# Altium schematic sheet SH4 - 17V BUCK CONVERTER.SchDoc: Power Distribution Board Rev2 - 17V Buck Converter
size Letter; DrawnBy: Cindy Li; Organization: Altium Limited; Address1: L3, 12a Rodborough Rd; Address2: Frenchs Forest; Address3: NSW; Address4: Australia 2086
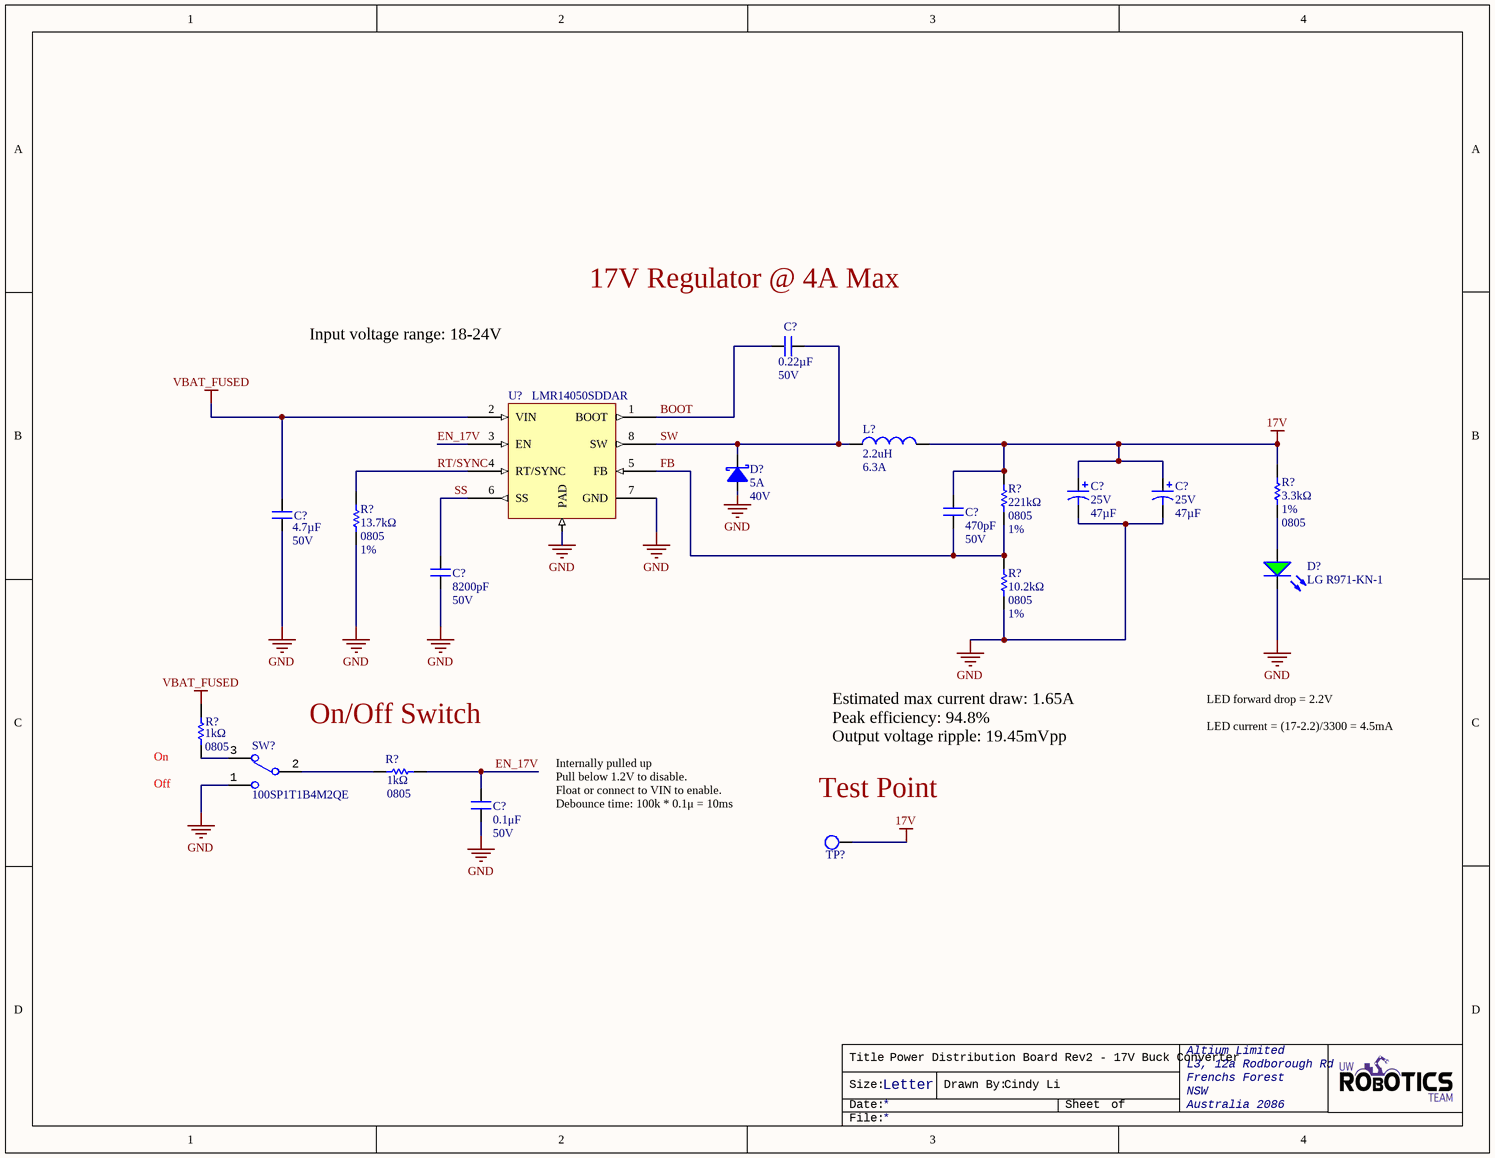
[diagram p0: SH4 - 17V BUCK CONVERTER.SchDoc]

## Parts
(Parts that share a designator on the sheet are numbered #1, #2 ... from top to bottom, then left to right.)
C?#1  Voltage Rating: 50V  Capacitance: 0.22µF  [CAP 0805_2012]  (hidden comment: GRM21BR71H224MA01L)
C?#2  Voltage: 25V  [25SVPF47M]  (hidden comment: 47μF)
C?#3  Voltage: 25V  [25SVPF47M]  (hidden comment: 47μF)
C?#4  470pF  Voltage Rating: 50V  [CAP 0805_2012]
C?#5  Voltage Rating: 50V  Capacitance: 4.7µF  [CAPC1206(3216)]  (hidden comment: GRM31CR71H475KA12L)
C?#6  8200pF  Voltage Rating: 50V  [CAP 0805_2012]
C?#7  0.1μF  Voltage Rating: 50V  [CAPC2012X140N]
D?#1  Forward Current: 5A  Voltage: 40V  [DO214AB SMC]  (hidden comment: B540C-13-F)
D?#2  LG R971-KN-1  [LED_0805_LINE]
L?  Inductance: 2.2uH  Max DC Current: 6.3A  [IND_BOURNS_SRN80]  (hidden comment: SRN8040-2R2Y)
R?#1  3.3kΩ  Tolerance: 1%  Case Code (Imperial): 0805  [RESC2012X60N]
R?#2  221kΩ  Case Code (Imperial): 0805  Tolerance: 1%  [RESC2012X60N]
R?#3  13.7kΩ  Case Code (Imperial): 0805  Tolerance: 1%  [RESC2012X60N]
R?#4  10.2kΩ  Case Code (Imperial): 0805  Tolerance: 1%  [RESC2012X60N]
R?#5  Case Code (Imperial): 0805  [RESC2012X60N]  (hidden comment: 1kΩ)
R?#6  1kΩ  Case Code (Imperial): 0805  [RESC2012X60N]
SW?  100SP1T1B4M2QE  [100SP1T1B4M2QE]
TP?  TESTPOINT_LOOP  [TESTPOINT_LOOP]  (value not drawn)
U?  LMR14050SDDAR  [8-PowerSOIC]

## Nets
17V: C?#2.1 C?#3.1 C?#4.2 L?.2 R?#1.2 R?#2.2 TP?.1
GND: C?#2.2 C?#3.2 C?#5.2 C?#6.1 C?#7.1 D?#1.1(Anode) D?#2.2(K) R?#3.1 R?#4.1 SW?.1 U?.7(GND) U?.9(PAD)
VBAT_FUSED: C?#5.1 R?#5.2 U?.2(VIN)
BOOT: C?#1.2 U?.1(BOOT)
EN_17V: C?#7.2 R?#6.2 U?.3(EN)
FB: C?#4.1 R?#2.1 R?#4.2 U?.5(FB)
RT/SYNC: R?#3.2 U?.4(RT/SYNC)
SS: C?#6.2 U?.6(SS)
SW: C?#1.1 D?#1.2(Cathode) L?.1 U?.8(SW)
NetD?#2_1: D?#2.1(A) R?#1.1
NetR?#5_1: R?#5.1 SW?.3
NetR?#6_1: R?#6.1 SW?.2

## Notes on the sheet
- (near C?#1) 17V Regulator @ 4A Max
- Input voltage range: 18-24V
- (near R?#5) On
- On/Off Switch
- Estimated max current draw: 1.65A
  Peak efficiency: 94.8%
  Output voltage ripple: 19.45mVpp
- LED forward drop = 2.2V
  LED current = (17-2.2)/3300 = 4.5mA
- (near R?#5) Off
- Internally pulled up
  Pull below 1.2V to disable.
  Float or connect to VIN to enable.
  Debounce time: 100k * 0.1μ = 10ms
- (near TP?) Test Point
- Title
- Size:
- Date:
- Letter
- Drawn By:
- Sheet
- of
- File:

## Library data of the parts
C?#1 = GRM21BR71H224MA01L: CAP CER 0.22UF 50V X7R 0805; Manufacturer 1: Murata; Tolerance: 20%; Manufacturer Part Number 1: GRM21BR71H224MA01L; Mount: Surface Mount; Case/Package: 0805; Case Code (Metric): 2012; Case Code (Imperial): 0805; Min Operating Temperature: -55°C; Max Operating Temperature: 125°C; Dielectric: X7R; Termination: SMD/SMT; Voltage Rating (DC): 50V; Length: 2mm; Height: 1.25mm; Width: 0.049inch; Thickness: 0.053inch; Depth: 1.25mm; Supplier 1: Digi-Key; Supplier Part Number 1: 490-1671-1-ND; Package: 0805 (2012 Metric)
C?#2 C?#3 = 25SVPF47M: CAP ALUM POLY 47UF 20% 25V SMD; Manufacturer 1: Panasonic; Polarity: Polar; Leakage Current: 235uA; Life (Hours): 5000Hour; Dissipation Factor: 12%; ESR (Equivalent Series Resistance): 30mR; Ripple Current: 2.8A; Clamping Voltage: 35.5V; Peak Pulse Power: 400W; Reverse Standoff Voltage: 22V; Peak Pulse Current: 11.3A; Test Current: 1mA; Breakdown Voltage: 24.4V; Number of Channels: 1; Direction: Unidirectional; Max Reverse Leakage Current: 1uA; Element Configuration: Single; Max Breakdown Voltage: 26.9V; Max Forward Surge Current (Ifsm): 40A; Working Voltage: 3.5V; Current: 113A; Supplier 1: Digi-Key; Manufacturer Part Number 1: 25SVPF47M; Mount: Surface Mount; Case/Package: Radial; Number of Pins: 6; Min Operating Temperature: -55°C; Max Operating Temperature: 105°C; Termination: SMD/SMT; Tolerance: 20%; Voltage Rating: 25V; Ripple Current (AC): 2.8A; Voltage Rating (DC): 25V; Diameter: 6.3mm; Length: 5.9mm; Height: 5.9mm; Height - Seated (Max): 0.236inch; REACH SVHC: No SVHC; Supplier Part Number 1: P16513CT-ND; Capacitance: 47µF; Max Surge Current: 11.3A; Operating Supply Voltage: 22V; Min Breakdown Voltage: 24.4V; Number of Elements: 1; Reverse Breakdown Voltage: 24.4V; Max Power Dissipation: 400W; Power Dissipation: 400W; Width: 0.11inch
C?#4 = CAP_470pF_50V_0805: CAP CER 470PF 50V X7R 0805; Manufacturer 1: Kyocera AVX; Manufacturer Part Number 1: 08055C471JAT2A; Tolerance: 5%; Dissipation Factor: 2.5%; Supplier 1: Digi-Key; Mount: Surface Mount; Number of Pins: 2; Case Code (Metric): 2012; Case Code (Imperial): 0805; Min Operating Temperature: -55°C; Max Operating Temperature: 125°C; Dielectric: X7R; Voltage Rating (DC): 50V; Termination: SMD/SMT; Length: 2.01mm; Height: 0.94mm; Width: 0.049inch; Thickness: 0.037inch; Depth: 1.25mm; REACH SVHC: Unknown; ComponentLink7URL: https://datasheet.ciiva.com/14906/cx7r-14906253.pdf?src-supplier=Digi-Key; ComponentLink7Description: https://datasheet.ciiva.com/14906/cx7r-14906253.pdf?src-supplier=Digi-Key; Supplier Part Number 1: 478-7958-1-ND; Capacitance: 470pF; Package: 0805 (2012 Metric); Contact Plating: Tin,Matte
C?#5 = GRM31CR71H475KA12L: CAP CER 4.7UF 50V X7R 1206; Manufacturer 1: Murata; Material: Ceramic; Tolerance: 10%; Value: 4.7µF; Supplier 1: Digi-Key; Manufacturer Part Number 1: GRM31CR71H475KA12L; Mount: Surface Mount; Case/Package: 1206; Case Code (Metric): 3216; Case Code (Imperial): 1206; Min Operating Temperature: -55°C; Max Operating Temperature: 125°C; Dielectric: X7R; Voltage Rating (DC): 50V; Termination: SMD/SMT; Voltage: 50V; Length: 3.2mm; Height: 1.6mm; Width: 0.063inch; Thickness: 0.071inch; Depth: 1.6mm; REACH SVHC: No SVHC; ComponentLink7URL: https://datasheet.ciiva.com/6270/partnumbering-e-01-6270218.pdf?src-supplier=Digi-Key; ComponentLink7Description: https://datasheet.ciiva.com/6270/partnumbering-e-01-6270218.pdf?src-supplier=Digi-Key; ComponentLink8URL: https://datasheet.ciiva.com/6270/partnumbering-e-01-6270219.pdf?src-supplier=Digi-Key; ComponentLink8Description: https://datasheet.ciiva.com/6270/partnumbering-e-01-6270219.pdf?src-supplier=Digi-Key; Supplier Part Number 1: 490-6521-1-ND; Package: 1206 (3216 Metric)
C?#6 = CAP_8200pF_50V_0805: CAP CER 8200PF 50V X7R 0805; Tolerance: 10%; Capacitance: 8.2nF; Mount: Surface Mount; Case Code (Metric): 2012; Case Code (Imperial): 0805; Min Operating Temperature: -55°C; Max Operating Temperature: 125°C; Dielectric: X7R; Voltage Rating (DC): 50V; Termination: SMD/SMT; Length: 0.079inch; Width: 0.049inch; Thickness: 0.037inch; Depth: 1.25mm; Supplier 1: Digi-Key; Supplier Part Number 1: 478-9924-6-ND; Number of Pins: 2; Ratings: AEC-Q200; Package: 0805 (2012 Metric)
C?#7 = CAP_0.1uF_50V_0805: CAP CER 0.1UF 50V X7R 0805; Manufacturer Part Number 1: GCD21BR71H104KA01L; Manufacturer 1: Murata Electronics; Tolerance: 10%; Package: 0805 (2012 Metric); Supplier Part Number 1: 490-11955-1-ND; Supplier 1: Digi-Key; Mount: Surface Mount; Value: 0.1μF; Case Code (Imperial): 0805; Case Code (Metric): 2012; Dielectric: X7R; Min Operating Temperature: -55°C; Max Operating Temperature: 125°C; Termination: SMD/SMT; Length: 2mm; Height: 1.25mm; Width: 0.049inch; Thickness: 0.049inch; Depth: 1.25mm; Ratings: AEC-Q200
D?#1 = B540C-13-F: DIODE SCHOTTKY 40V 5A SMC; Manufacturer 1: Diodes; Element Configuration: Single; Peak Reverse Current: 500uA; Peak Non-Repetitive Surge Current: 100A; Forward Voltage: 550mV; Polarity: Standard; Capacitance: 300pF; Supplier 1: Digi-Key; Manufacturer Part Number 1: B540C-13-F; Mount: Surface Mount; Case/Package: SMC; Number of Pins: 2; Weight: 0.007408oz; Contact Plating: Tin,Matte; Min Operating Temperature: -55°C; Max Operating Temperature: 125°C; Max Repetitive Reverse Voltage (Vrrm): 40V; Max Forward Surge Current (Ifsm): 100A; Average Rectified Current: 5A; Termination: SMD/SMT; Voltage Rating (DC): 40V; Current Rating: 5A; Output Current: 5A; Max Reverse Voltage (DC): 40V; Current: 5A; Length: 7.11mm; Height: 2.5mm; Width: 6.22mm; REACH SVHC: No SVHC; ComponentLink7URL: https://datasheet.ciiva.com/8303/ds13012-8303112.pdf?src-supplier=Avnet; ComponentLink7Description: https://datasheet.ciiva.com/8303/ds13012-8303112.pdf?src-supplier=Avnet; ComponentLink8URL: https://datasheet.ciiva.com/25919/ds13012-25919706.pdf?src-supplier=Avnet+Europe; ComponentLink8Description: https://datasheet.ciiva.com/25919/ds13012-25919706.pdf?src-supplier=Avnet+Europe; ComponentLink9URL: https://datasheet.ciiva.com/16200/ds13012-16200443.pdf?src-supplier=Future+Electronics; ComponentLink9Description: https://datasheet.ciiva.com/16200/ds13012-16200443.pdf?src-supplier=Future+Electronics; Supplier Part Number 1: B540C-FDIDKR-ND
D?#2 = DIO_LED_G: LED GREEN DIFFUSED 0805 SMD; Manufacturer 1: OSRAM; Forward Voltage Drop: 2.2V; Package: 0805 (2012 Metric); Manufacturer Part Number 1: LG R971-KN-1; Supplier Part Number 1: 475-1410-1-ND; Supplier 1: Digi-Key; Mount: Surface Mount
L? = SRN8040-2R2Y: FIXED IND 2.2UH 6.3A 13 MOHM SMD; Manufacturer 1: Bourns; Core Material: Ferrite; Material: Steel; DC Resistance (DCR): 13mR; Tolerance: 30%; Self Resonant Frequency: 40MHz; Test Frequency: 100kHz; Shielding: Shielded; Saturation Current: 7.4A; Supplier 1: Digi-Key; Manufacturer Part Number 1: SRN8040-2R2Y; Mount: Surface Mount; Case/Package: Nonstandard; Number of Pins: 2; Weight: 0.028607oz; Contact Plating: Tin; Min Operating Temperature: -40°C; Max Operating Temperature: 125°C; Termination: SMD/SMT; Composition: Wirewound; DC Current: 6.3A; Military Standard: Not; RMS Current (Irms): 6.3A; Inductance Tolerance: 30%; Current Rating: 6.3A; Length: 8mm; Height: 4mm; Height - Seated (Max): 0.157inch; Depth: 8.3mm; Width: 8mm; REACH SVHC: No SVHC; ComponentLink7URL: https://datasheet.ciiva.com/1049/srn8040-1049455.pdf?src-supplier=Digi-Key; ComponentLink7Description: https://datasheet.ciiva.com/1049/srn8040-1049455.pdf?src-supplier=Digi-Key; ComponentLink8URL: https://datasheet.ciiva.com/17284/srn8040-17284783.pdf?src-supplier=Avnet+Europe; ComponentLink8Description: https://datasheet.ciiva.com/17284/srn8040-17284783.pdf?src-supplier=Avnet+Europe; ComponentLink9URL: https://datasheet.ciiva.com/48691/001056460-da-01-en-mag-abg-leist-ind-srn8040-2r2y-2-2uh-smd-48691836.pdf?src-supplier=Conrad; ComponentLink9Description: https://datasheet.ciiva.com/48691/001056460-da-01-en-mag-abg-leist-ind-srn8040-2r2y-2-2uh-smd-48691836.pdf?src-supplier=Conrad; Supplier Part Number 1: SRN8040-2R2YCT-ND
R?#1 = RES_3.3kΩ_0805: RES SMD 3.3K OHM 1% 1/8W 0805; Resistance: 3.3kR; Temperature Coefficient: 100ppm/°C; Power Rating: 125mW; Voltage Rating: 150V; Package: 0805 (2012 Metric); Supplier 1: Digi-Key; Mount: Surface Mount; Case Code (Metric): 2012; Weight: 0.000194oz; Contact Plating: Tin; Min Operating Temperature: -55°C; Max Operating Temperature: 155°C; Composition: Thick Film; Number of Terminations: 2; Termination: SMD/SMT; Max Power Dissipation: 125mW; Voltage Rating (DC): 150V; Features: Automotive AEC-Q200; Military Standard: Not; Length: 2mm; Height: 0.45mm; Width: 1.25mm; Depth: 1.25mm; REACH SVHC: Unknown; ComponentLink7URL: https://datasheet.ciiva.com/2467/dcrcwe3-2467823.pdf?src-supplier=Digi-Key; ComponentLink7Description: https://datasheet.ciiva.com/2467/dcrcwe3-2467823.pdf?src-supplier=Digi-Key; ComponentLink8URL: https://datasheet.ciiva.com/9080/dcrcwe3-9080591.pdf?src-supplier=Avnet; ComponentLink8Description: https://datasheet.ciiva.com/9080/dcrcwe3-9080591.pdf?src-supplier=Avnet; ComponentLink9URL: https://datasheet.ciiva.com/16430/dcrcwe3-16430277.pdf?src-supplier=Future+Electronics; ComponentLink9Description: https://datasheet.ciiva.com/16430/dcrcwe3-16430277.pdf?src-supplier=Future+Electronics; ComponentLink10URL: https://datasheet.ciiva.com/26312/fld-crcw-e3-data-en-26312934.pdf?src-supplier=Distrelec; ComponentLink10Description: https://datasheet.ciiva.com/26312/fld-crcw-e3-data-en-26312934.pdf?src-supplier=Distrelec; ComponentLink11URL: https://datasheet.ciiva.com/16778/70201119-16778680.pdf?src-supplier=Allied+Electronics; ComponentLink11Description: https://datasheet.ciiva.com/16778/70201119-16778680.pdf?src-supplier=Allied+Electronics; Supplier Part Number 1: 541-3.30KHCT-ND
R?#2 = RES_221kΩ_0805: RES SMD 221K OHM 1% 1/8W 0805; Manufacturer 1: Vishay; Manufacturer Part Number 1: CRCW0805221KFKEA; Power Rating: 125mW; Voltage Rating: 150V; Temperature Coefficient: 100ppm/°C; Resistance: 221kR; Supplier 1: Digi-Key; Mount: Surface Mount; Contact Plating: Tin; Case Code (Metric): 2012; Min Operating Temperature: -55°C; Max Operating Temperature: 155°C; Voltage Rating (DC): 150V; Composition: Thick Film; Number of Terminations: 2; Termination: SMD/SMT; Military Standard: Not; Features: Automotive AEC-Q200; Length: 2mm; Height: 0.45mm; Width: 1.25mm; Depth: 1.25mm; REACH SVHC: Unknown; ComponentLink7URL: https://datasheet.ciiva.com/2467/dcrcwe3-2467622.pdf?src-supplier=Digi-Key; ComponentLink7Description: https://datasheet.ciiva.com/2467/dcrcwe3-2467622.pdf?src-supplier=Digi-Key; ComponentLink8URL: https://datasheet.ciiva.com/3258/dcrcwe3-3258329.pdf?src-supplier=Avnet; ComponentLink8Description: https://datasheet.ciiva.com/3258/dcrcwe3-3258329.pdf?src-supplier=Avnet; Supplier Part Number 1: 541-221KCCT-ND; Max Power Dissipation: 125mW; Number of Pins: 2; Weight: 0.000194oz; ComponentLink9URL: https://datasheet.ciiva.com/7674/1533075-7674218.pdf?src-supplier=Element14; ComponentLink9Description: https://datasheet.ciiva.com/7674/1533075-7674218.pdf?src-supplier=Element14; ComponentLink10URL: https://datasheet.ciiva.com/22870/70201119-22870172.pdf?src-supplier=Allied+Electronics; ComponentLink10Description: https://datasheet.ciiva.com/22870/70201119-22870172.pdf?src-supplier=Allied+Electronics; Package: 0805 (2012 Metric)
R?#3 = RES_13.7kΩ_0805: RES SMD 13.7K OHM 1% 1/8W 0805; Manufacturer 1: Vishay; Manufacturer Part Number 1: CRCW080513K7FKEA; Temperature Coefficient: 100ppm/°C; Voltage Rating (DC): 150V; Power Rating: 125mW; Resistance: 13.7kR; Supplier 1: Digi-Key; Number of Pins: 2; Weight: 0.000194oz; Case Code (Metric): 2012; Contact Plating: Tin; Min Operating Temperature: -55°C; Max Operating Temperature: 155°C; Composition: Thick Film; Termination: SMD/SMT; Military Standard: Not; Length: 2mm; Height: 0.45mm; Width: 0.049inch; Depth: 1.25mm; REACH SVHC: Unknown; Supplier Part Number 1: 541-13.7KCCT-ND; Voltage Rating: 150V; Number of Terminations: 2; Max Power Dissipation: 125mW; Features: Automotive AEC-Q200; ComponentLink7URL: https://datasheet.ciiva.com/22675/1847332-22675191.pdf?src-supplier=Element14; ComponentLink7Description: https://datasheet.ciiva.com/22675/1847332-22675191.pdf?src-supplier=Element14; ComponentLink8URL: https://datasheet.ciiva.com/7663/1697337-7663928.pdf?src-supplier=Element14; ComponentLink8Description: https://datasheet.ciiva.com/7663/1697337-7663928.pdf?src-supplier=Element14; ComponentLink9URL: https://datasheet.ciiva.com/3258/dcrcwe3-3258107.pdf?src-supplier=Avnet; ComponentLink9Description: https://datasheet.ciiva.com/3258/dcrcwe3-3258107.pdf?src-supplier=Avnet; ComponentLink10URL: https://datasheet.ciiva.com/16778/70201119-16778860.pdf?src-supplier=Allied+Electronics; ComponentLink10Description: https://datasheet.ciiva.com/16778/70201119-16778860.pdf?src-supplier=Allied+Electronics; ComponentLink11URL: https://datasheet.ciiva.com/17188/dcrcwe3-17188109.pdf?src-supplier=Avnet+Europe; ComponentLink11Description: https://datasheet.ciiva.com/17188/dcrcwe3-17188109.pdf?src-supplier=Avnet+Europe; Package: 0805 (2012 Metric)
R?#4 = RES_10.2kΩ_0805: RES SMD 10.2K OHM 1% 1/8W 0805; Manufacturer 1: Vishay; Manufacturer Part Number 1: CRCW080510K2FKEA; Temperature Coefficient: 100ppm/°C; Power Rating: 125mW; Voltage Rating: 150V; Resistance: 10.2kR; Supplier 1: Digi-Key; Number of Pins: 2; Weight: 0.000194oz; Contact Plating: Tin; Case Code (Metric): 2012; Min Operating Temperature: -55°C; Max Operating Temperature: 155°C; Composition: Thick Film; Features: Automotive AEC-Q200; Termination: SMD/SMT; Number of Terminations: 2; Military Standard: Not; Length: 2mm; Height: 0.45mm; Width: 0.049inch; Depth: 1.25mm; REACH SVHC: Unknown; ComponentLink7URL: https://datasheet.ciiva.com/22702/1697337-22702902.pdf?src-supplier=Element14; ComponentLink7Description: https://datasheet.ciiva.com/22702/1697337-22702902.pdf?src-supplier=Element14; ComponentLink8URL: https://datasheet.ciiva.com/16204/dcrcwe3-16204135.pdf?src-supplier=Future+Electronics; ComponentLink8Description: https://datasheet.ciiva.com/16204/dcrcwe3-16204135.pdf?src-supplier=Future+Electronics; ComponentLink9URL: https://datasheet.ciiva.com/16852/dcrcwe3-16852825.pdf?src-supplier=Avnet+Europe; ComponentLink9Description: https://datasheet.ciiva.com/16852/dcrcwe3-16852825.pdf?src-supplier=Avnet+Europe; ComponentLink10URL: https://datasheet.ciiva.com/7663/1697337-7663915.pdf?src-supplier=Element14; ComponentLink10Description: https://datasheet.ciiva.com/7663/1697337-7663915.pdf?src-supplier=Element14; ComponentLink11URL: https://datasheet.ciiva.com/7663/1697337-7663916.pdf?src-supplier=Element14; ComponentLink11Description: https://datasheet.ciiva.com/7663/1697337-7663916.pdf?src-supplier=Element14; ComponentLink12URL: https://datasheet.ciiva.com/22674/1825492-22674606.pdf?src-supplier=Element14; ComponentLink12Description: https://datasheet.ciiva.com/22674/1825492-22674606.pdf?src-supplier=Element14; ComponentLink13URL: https://datasheet.ciiva.com/3258/dcrcwe3-3258031.pdf?src-supplier=Avnet; ComponentLink13Description: https://datasheet.ciiva.com/3258/dcrcwe3-3258031.pdf?src-supplier=Avnet; Supplier Part Number 1: 541-10.2KCCT-ND; Max Power Dissipation: 125mW; Package: 0805 (2012 Metric); Voltage Rating (DC): 150V; Working Voltage: 150V
R?#5 = RES_1kΩ_0805: RES SMD 1K OHM 1% 1/8W 0805; Manufacturer 1: Yageo; Manufacturer Part Number 1: RC0805FR-071KL; Power Rating: 125mW; Temperature Coefficient: 25ppm/°C; Voltage Rating: 150V; Supplier 1: Digi-Key; Case Code (Metric): 2012; Min Operating Temperature: -55°C; Max Operating Temperature: 155°C; Resistance: 1K; Tolerance: 1%; Termination: SMD/SMT; Supplier Part Number 1: 311-1.00KCRCT-ND; Package: 0805 (2012 Metric); Mount: Surface Mount; Case/Package: 0805; Number of Pins: 2; Weight: 0.000194oz; Contact Plating: Tin; Composition: Thin Film; Number of Terminations: 2; Voltage Rating (DC): 150V; Max Power Dissipation: 125mW; Features: Moisture Resistant,Automotive AEC-Q200,Anti-Sulfur; Military Standard: Not; Length: 2mm; Height: 0.022inch; Width: 0.049inch; Depth: 1.25mm; REACH SVHC: Unknown; Value: 1kΩ
R?#6 = RES_100kΩ_0805: RES SMD 100K OHM 0.5% 1/8W 0805; Manufacturer 1: Panasonic; Manufacturer Part Number 1: ERA-6AED104V; Resistance: 100kΩ; Power Rating: 125mW; Temperature Coefficient: 25ppm/°C; Voltage Rating: 200V; Package: 0805 (2012 Metric); Supplier Part Number 1: P123795CT-ND; Supplier 1: Digi-Key; Case Code (Metric): 2012; Tolerance: 0.5%; Min Operating Temperature: -55°C; Max Operating Temperature: 155°C; Termination: SMD/SMT; Mount: Surface Mount; Contact Plating: Tin; Composition: Thin Film; Military Standard: Not; Length: 2mm; Height: 0.5mm; Width: 1.25mm; Depth: 1.25mm; Category: Chip SMD Resistors
SW? = SW_SPDT: SWITCH TOGGLE SPDT 5A 120V; Manufacturer 1: E-Switch; Actuator Material: Brass,Chrome; Electrical Life: 40000Cycles; Actuator Type: Standard Round; Voltage Rating (DC): 28V; Illumination Type: Non-Illuminated,Illuminated; Switch Function: On-On; Actuator Length: 12.19mm; Supplier 1: Digi-Key; Manufacturer Part Number 1: 100SP1T1B4M2QE; Mount: Through Hole; Contact Material: Silver; Contact Plating: Silver; Min Operating Temperature: -30°C; Max Operating Temperature: 85°C; Termination: PC Pin; Throw Configuration: SPDT; Orientation: Vertical; Voltage Rating (AC): 120V; Supplier Part Number 1: EG2355-ND; Current Rating: 5A
TP? = TESTPOINT_LOOP: PC TEST POINT MINIATURE WHITE; Manufacturer 1: Keystone Electronics; Manufacturer Part Number 1: 5002; Supplier Part Number 1: 36-5002-ND; Supplier 1: Digi-Key; Mount: Through Hole
U? = LMR14050SDDAR: IC REG BUCK ADJUSTABLE 5A 8SOPWR; Manufacturer 1: Texas Instruments; Output Configuration: Positive; Number of Outputs: 1; Min Input Voltage: 4V; Max Input Voltage: 40V; Min Output Voltage: 800mV; Max Output Voltage: 28V; Switching Frequency: 2.5MHz; Synchronous Rectifier: No; Quiescent Current: 40uA; Supplier 1: Digi-Key; Manufacturer Part Number 1: LMR14050SDDAR; Mount: Surface Mount; Number of Pins: 8; Min Operating Temperature: -40°C; Max Operating Temperature: 125°C; Output Type: Adjustable; Output Current: 5A; Case/Package: 8-PowerSOIC; Supplier Part Number 1: 296-44322-1-ND